# Altium project R32-Micro.PrjPCB
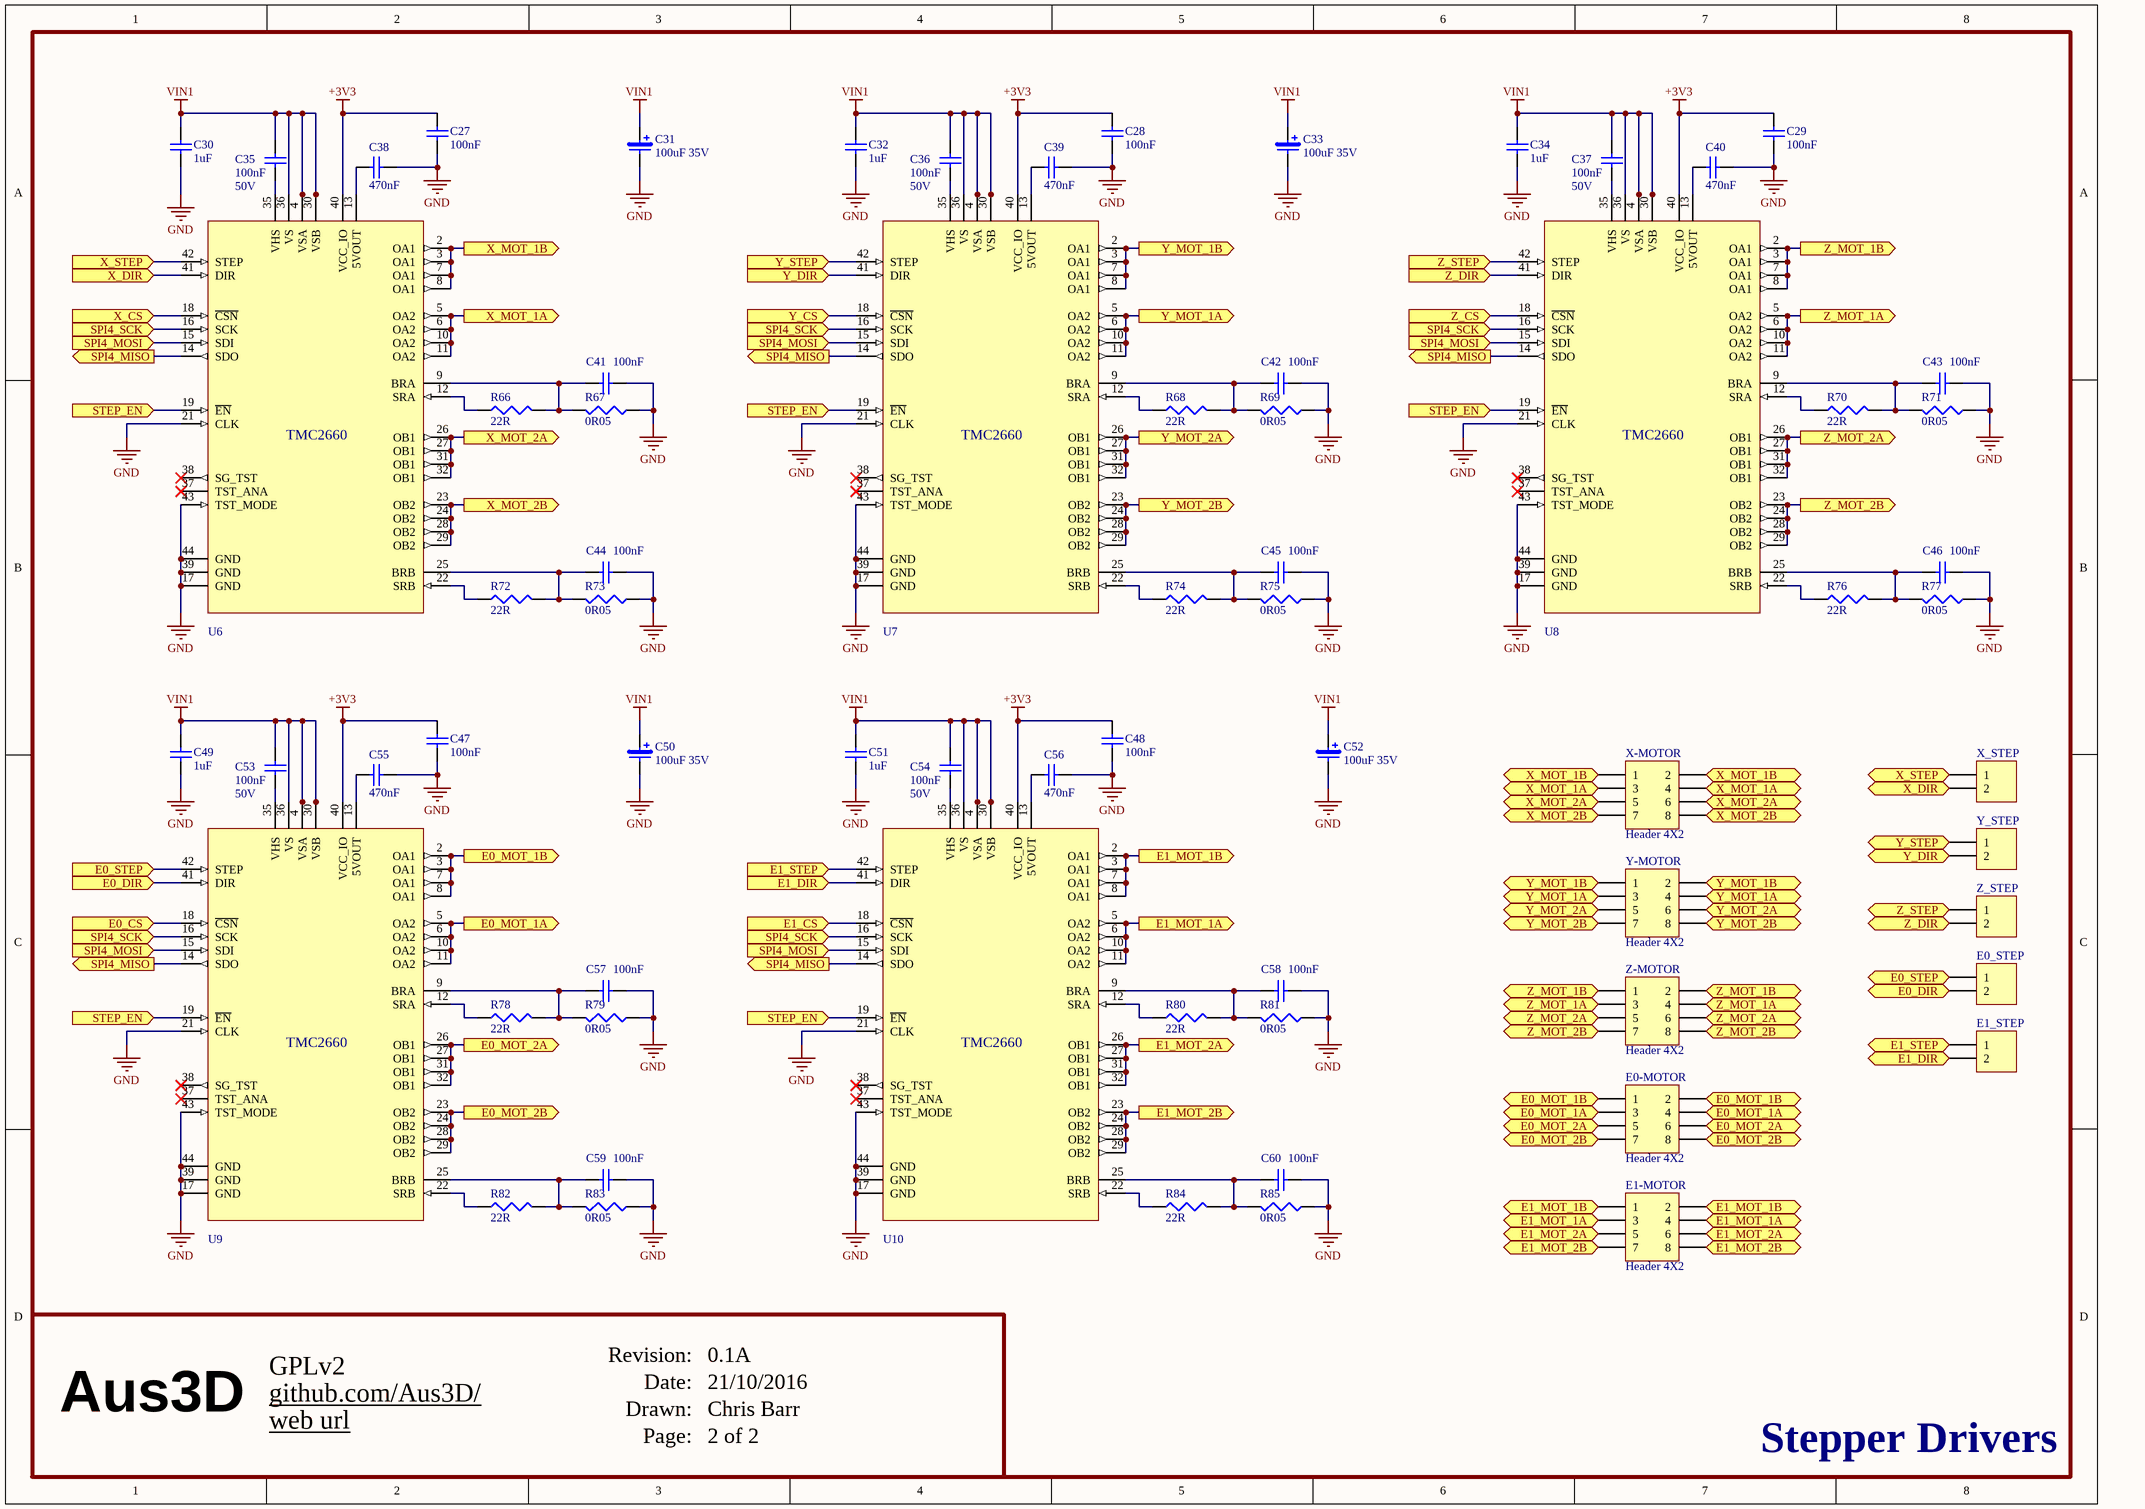
[diagram p0: stepperDrivers.SchDoc]
2 sheets, 220 parts. Net scope: flat (ports and power ports of the same name join across sheets).
Board file: R32-Micro.PcbDoc
Sheets:
  stepperDrivers.SchDoc
  R32-Micro.SchDoc

## Sheet stepperDrivers.SchDoc
size A3

### Parts
C27  value 100nF  [CAP 1005-0402]  (hidden comment: CapC-0402-100nF)
C28  value 100nF  [CAP 1005-0402]  (hidden comment: CapC-0402-100nF)
C29  value 100nF  [CAP 1005-0402]  (hidden comment: CapC-0402-100nF)
C30  value 1uF  [Cap 1608-0603]  (hidden comment: CapC-0603-1uF 50V)
C31  value 100uF 35V  [CAP EL PANASONIC]  (hidden comment: CapE-6.3-100uF-35V)
C32  value 1uF  [Cap 1608-0603]  (hidden comment: CapC-0603-1uF 50V)
C33  value 100uF 35V  [CAP EL PANASONIC]  (hidden comment: CapE-6.3-100uF-35V)
C34  value 1uF  [Cap 1608-0603]  (hidden comment: CapC-0603-1uF 50V)
C35  value 100nF  Voltage: 50V  [CAP 1005-0402]  (hidden comment: CapC-0402-100nF-50V)
C36  value 100nF  Voltage: 50V  [CAP 1005-0402]  (hidden comment: CapC-0402-100nF-50V)
C37  value 100nF  Voltage: 50V  [CAP 1005-0402]  (hidden comment: CapC-0402-100nF-50V)
C38  value 470nF  [CAP 1005-0402]  (hidden comment: CapC-0402-470nF)
C39  value 470nF  [CAP 1005-0402]  (hidden comment: CapC-0402-470nF)
C40  value 470nF  [CAP 1005-0402]  (hidden comment: CapC-0402-470nF)
C41  value 100nF  [CAP 1005-0402]  (hidden comment: CapC-0402-100nF)
C42  value 100nF  [CAP 1005-0402]  (hidden comment: CapC-0402-100nF)
C43  value 100nF  [CAP 1005-0402]  (hidden comment: CapC-0402-100nF)
C44  value 100nF  [CAP 1005-0402]  (hidden comment: CapC-0402-100nF)
C45  value 100nF  [CAP 1005-0402]  (hidden comment: CapC-0402-100nF)
C46  value 100nF  [CAP 1005-0402]  (hidden comment: CapC-0402-100nF)
C47  value 100nF  [CAP 1005-0402]  (hidden comment: CapC-0402-100nF)
C48  value 100nF  [CAP 1005-0402]  (hidden comment: CapC-0402-100nF)
C49  value 1uF  [Cap 1608-0603]  (hidden comment: CapC-0603-1uF 50V)
C50  value 100uF 35V  [CAP EL PANASONIC]  (hidden comment: CapE-6.3-100uF-35V)
C51  value 1uF  [Cap 1608-0603]  (hidden comment: CapC-0603-1uF 50V)
C52  value 100uF 35V  [CAP EL PANASONIC]  (hidden comment: CapE-6.3-100uF-35V)
C53  value 100nF  Voltage: 50V  [CAP 1005-0402]  (hidden comment: CapC-0402-100nF-50V)
C54  value 100nF  Voltage: 50V  [CAP 1005-0402]  (hidden comment: CapC-0402-100nF-50V)
C55  value 470nF  [CAP 1005-0402]  (hidden comment: CapC-0402-470nF)
C56  value 470nF  [CAP 1005-0402]  (hidden comment: CapC-0402-470nF)
C57  value 100nF  [CAP 1005-0402]  (hidden comment: CapC-0402-100nF)
C58  value 100nF  [CAP 1005-0402]  (hidden comment: CapC-0402-100nF)
C59  value 100nF  [CAP 1005-0402]  (hidden comment: CapC-0402-100nF)
C60  value 100nF  [CAP 1005-0402]  (hidden comment: CapC-0402-100nF)
E0-MOTOR  Header 4X2  [HDR2X4-HEADER]
E0_STEP  Header 2  [HEADER-1x2-50mil]  (value not drawn)
E1-MOTOR  Header 4X2  [HDR2X4-HEADER]
E1_STEP  Header 2  [HEADER-1x2-50mil]  (value not drawn)
R66  value 22R  [RESC1005X40N]  (hidden comment: Res-0402-22R)
R67  value 0R05  [Res 3216-1206]  (hidden comment: Res-1206-0R05)
R68  value 22R  [RESC1005X40N]  (hidden comment: Res-0402-22R)
R69  value 0R05  [Res 3216-1206]  (hidden comment: Res-1206-0R05)
R70  value 22R  [RESC1005X40N]  (hidden comment: Res-0402-22R)
R71  value 0R05  [Res 3216-1206]  (hidden comment: Res-1206-0R05)
R72  value 22R  [RESC1005X40N]  (hidden comment: Res-0402-22R)
R73  value 0R05  [Res 3216-1206]  (hidden comment: Res-1206-0R05)
R74  value 22R  [RESC1005X40N]  (hidden comment: Res-0402-22R)
R75  value 0R05  [Res 3216-1206]  (hidden comment: Res-1206-0R05)
R76  value 22R  [RESC1005X40N]  (hidden comment: Res-0402-22R)
R77  value 0R05  [Res 3216-1206]  (hidden comment: Res-1206-0R05)
R78  value 22R  [RESC1005X40N]  (hidden comment: Res-0402-22R)
R79  value 0R05  [Res 3216-1206]  (hidden comment: Res-1206-0R05)
R80  value 22R  [RESC1005X40N]  (hidden comment: Res-0402-22R)
R81  value 0R05  [Res 3216-1206]  (hidden comment: Res-1206-0R05)
R82  value 22R  [RESC1005X40N]  (hidden comment: Res-0402-22R)
R83  value 0R05  [Res 3216-1206]  (hidden comment: Res-1206-0R05)
R84  value 22R  [RESC1005X40N]  (hidden comment: Res-0402-22R)
R85  value 0R05  [Res 3216-1206]  (hidden comment: Res-1206-0R05)
U6  TMC2660  [TQFP80P1200X1200X160-44N]  (value not drawn)
U7  TMC2660  [TQFP80P1200X1200X160-44N]  (value not drawn)
U8  TMC2660  [TQFP80P1200X1200X160-44N]  (value not drawn)
U9  TMC2660  [TQFP80P1200X1200X160-44N]  (value not drawn)
U10  TMC2660  [TQFP80P1200X1200X160-44N]  (value not drawn)
X-MOTOR  Header 4X2  [HDR2X4-HEADER]
X_STEP  Header 2  [HEADER-1x2-50mil]  (value not drawn)
Y-MOTOR  Header 4X2  [HDR2X4-HEADER]
Y_STEP  Header 2  [HEADER-1x2-50mil]  (value not drawn)
Z-MOTOR  Header 4X2  [HDR2X4-HEADER]
Z_STEP  Header 2  [HEADER-1x2-50mil]  (value not drawn)

### Ports
E0_CS (in), E0_DIR (in), E0_MOT_1A (in), E0_MOT_1A (out), E0_MOT_1B (in), E0_MOT_1B (out), E0_MOT_2A (in), E0_MOT_2A (out), E0_MOT_2B (in), E0_MOT_2B (out), E0_STEP (in), E1_CS (in), E1_DIR (in), E1_MOT_1A (in), E1_MOT_1A (out), E1_MOT_1B (in), E1_MOT_1B (out), E1_MOT_2A (in), E1_MOT_2A (out), E1_MOT_2B (in), E1_MOT_2B (out), E1_STEP (in), SPI4_MISO (out), SPI4_MOSI (in), SPI4_SCK (in), STEP_EN (in), X_CS (in), X_DIR (in), X_MOT_1A (in), X_MOT_1A (out), X_MOT_1B (in), X_MOT_1B (out), X_MOT_2A (in), X_MOT_2A (out), X_MOT_2B (in), X_MOT_2B (out), X_STEP (in), Y_CS (in), Y_DIR (in), Y_MOT_1A (in), Y_MOT_1A (out), Y_MOT_1B (in), Y_MOT_1B (out), Y_MOT_2A (in), Y_MOT_2A (out), Y_MOT_2B (in), Y_MOT_2B (out), Y_STEP (in), Z_CS (in), Z_DIR (in), Z_MOT_1A (in), Z_MOT_1A (out), Z_MOT_1B (in), Z_MOT_1B (out), Z_MOT_2A (in), Z_MOT_2A (out), Z_MOT_2B (in), Z_MOT_2B (out), Z_STEP (in)

### Nets
+3V3: C27.2 C28.2 C29.2 C47.2 C48.2 U6.40(VCC_IO) U7.40(VCC_IO) U8.40(VCC_IO) U9.40(VCC_IO) U10.40(VCC_IO)
GND: C27.1 C28.1 C29.1 C30.1 C31.2 C32.1 C33.2 C34.1 C38.1 C39.1 C40.1 C41.1 C42.1 C43.1 C44.1 C45.1 C46.1 C47.1 C48.1 C49.1 C50.2 C51.1 C52.2 C55.1 C56.1 C57.1 C58.1 C59.1 C60.1 R67.1 R69.1 R71.1 R73.1 R75.1 R77.1 R79.1 R81.1 R83.1 R85.1 U6.17(GND) U6.21(CLK) U6.39(GND) U6.43(TST_MODE) U6.44(GND) U7.17(GND) U7.21(CLK) U7.39(GND) U7.43(TST_MODE) U7.44(GND) U8.17(GND) U8.21(CLK) U8.39(GND) U8.43(TST_MODE) U8.44(GND) U9.17(GND) U9.21(CLK) U9.39(GND) U9.43(TST_MODE) U9.44(GND) U10.17(GND) U10.21(CLK) U10.39(GND) U10.43(TST_MODE) U10.44(GND)
VIN1: C30.2 C31.1 C32.2 C33.1 C34.2 C35.2 C36.2 C37.2 C49.2 C50.1 C51.2 C52.1 C53.2 C54.2 U6.1(NC) U6.4(VSA) U6.30(VSB) U6.33(NC) U6.36(VS) U7.1(NC) U7.4(VSA) U7.30(VSB) U7.33(NC) U7.36(VS) U8.1(NC) U8.4(VSA) U8.30(VSB) U8.33(NC) U8.36(VS) U9.1(NC) U9.4(VSA) U9.30(VSB) U9.33(NC) U9.36(VS) U10.1(NC) U10.4(VSA) U10.30(VSB) U10.33(NC) U10.36(VS)
E0_CS: U9.18(~{CSN}) ; port E0_CS
E0_DIR: E0_STEP.2 U9.41(DIR) ; port E0_DIR
E0_MOT_1A: E0-MOTOR.3 E0-MOTOR.4 U9.5(OA2) U9.6(OA2) U9.10(OA2) U9.11(OA2) ; port E0_MOT_1A
E0_MOT_1B: E0-MOTOR.1 E0-MOTOR.2 U9.2(OA1) U9.3(OA1) U9.7(OA1) U9.8(OA1) ; port E0_MOT_1B
E0_MOT_2A: E0-MOTOR.5 E0-MOTOR.6 U9.26(OB1) U9.27(OB1) U9.31(OB1) U9.32(OB1) ; port E0_MOT_2A
E0_MOT_2B: E0-MOTOR.7 E0-MOTOR.8 U9.23(OB2) U9.24(OB2) U9.28(OB2) U9.29(OB2) ; port E0_MOT_2B
E0_STEP: E0_STEP.1 U9.42(STEP) ; port E0_STEP
E1_CS: U10.18(~{CSN}) ; port E1_CS
E1_DIR: E1_STEP.2 U10.41(DIR) ; port E1_DIR
E1_MOT_1A: E1-MOTOR.3 E1-MOTOR.4 U10.5(OA2) U10.6(OA2) U10.10(OA2) U10.11(OA2) ; port E1_MOT_1A
E1_MOT_1B: E1-MOTOR.1 E1-MOTOR.2 U10.2(OA1) U10.3(OA1) U10.7(OA1) U10.8(OA1) ; port E1_MOT_1B
E1_MOT_2A: E1-MOTOR.5 E1-MOTOR.6 U10.26(OB1) U10.27(OB1) U10.31(OB1) U10.32(OB1) ; port E1_MOT_2A
E1_MOT_2B: E1-MOTOR.7 E1-MOTOR.8 U10.23(OB2) U10.24(OB2) U10.28(OB2) U10.29(OB2) ; port E1_MOT_2B
E1_STEP: E1_STEP.1 U10.42(STEP) ; port E1_STEP
SPI4_MISO: U6.14(SDO) U7.14(SDO) U8.14(SDO) U9.14(SDO) U10.14(SDO) ; port SPI4_MISO
SPI4_MOSI: U6.15(SDI) U7.15(SDI) U8.15(SDI) U9.15(SDI) U10.15(SDI) ; port SPI4_MOSI
SPI4_SCK: U6.16(SCK) U7.16(SCK) U8.16(SCK) U9.16(SCK) U10.16(SCK) ; port SPI4_SCK
STEP_EN: U6.19(~{EN}) U7.19(~{EN}) U8.19(~{EN}) U9.19(~{EN}) U10.19(~{EN}) ; port STEP_EN
X_CS: U6.18(~{CSN}) ; port X_CS
X_DIR: U6.41(DIR) X_STEP.2 ; port X_DIR
X_MOT_1A: U6.5(OA2) U6.6(OA2) U6.10(OA2) U6.11(OA2) X-MOTOR.3 X-MOTOR.4 ; port X_MOT_1A
X_MOT_1B: U6.2(OA1) U6.3(OA1) U6.7(OA1) U6.8(OA1) X-MOTOR.1 X-MOTOR.2 ; port X_MOT_1B
X_MOT_2A: U6.26(OB1) U6.27(OB1) U6.31(OB1) U6.32(OB1) X-MOTOR.5 X-MOTOR.6 ; port X_MOT_2A
X_MOT_2B: U6.23(OB2) U6.24(OB2) U6.28(OB2) U6.29(OB2) X-MOTOR.7 X-MOTOR.8 ; port X_MOT_2B
X_STEP: U6.42(STEP) X_STEP.1 ; port X_STEP
Y_CS: U7.18(~{CSN}) ; port Y_CS
Y_DIR: U7.41(DIR) Y_STEP.2 ; port Y_DIR
Y_MOT_1A: U7.5(OA2) U7.6(OA2) U7.10(OA2) U7.11(OA2) Y-MOTOR.3 Y-MOTOR.4 ; port Y_MOT_1A
Y_MOT_1B: U7.2(OA1) U7.3(OA1) U7.7(OA1) U7.8(OA1) Y-MOTOR.1 Y-MOTOR.2 ; port Y_MOT_1B
Y_MOT_2A: U7.26(OB1) U7.27(OB1) U7.31(OB1) U7.32(OB1) Y-MOTOR.5 Y-MOTOR.6 ; port Y_MOT_2A
Y_MOT_2B: U7.23(OB2) U7.24(OB2) U7.28(OB2) U7.29(OB2) Y-MOTOR.7 Y-MOTOR.8 ; port Y_MOT_2B
Y_STEP: U7.42(STEP) Y_STEP.1 ; port Y_STEP
Z_CS: U8.18(~{CSN}) ; port Z_CS
Z_DIR: U8.41(DIR) Z_STEP.2 ; port Z_DIR
Z_MOT_1A: U8.5(OA2) U8.6(OA2) U8.10(OA2) U8.11(OA2) Z-MOTOR.3 Z-MOTOR.4 ; port Z_MOT_1A
Z_MOT_1B: U8.2(OA1) U8.3(OA1) U8.7(OA1) U8.8(OA1) Z-MOTOR.1 Z-MOTOR.2 ; port Z_MOT_1B
Z_MOT_2A: U8.26(OB1) U8.27(OB1) U8.31(OB1) U8.32(OB1) Z-MOTOR.5 Z-MOTOR.6 ; port Z_MOT_2A
Z_MOT_2B: U8.23(OB2) U8.24(OB2) U8.28(OB2) U8.29(OB2) Z-MOTOR.7 Z-MOTOR.8 ; port Z_MOT_2B
Z_STEP: U8.42(STEP) Z_STEP.1 ; port Z_STEP
NetC35_1: C35.1 U6.35(VHS)
NetC36_1: C36.1 U7.35(VHS)
NetC37_1: C37.1 U8.35(VHS)
NetC38_2: C38.2 U6.13(5VOUT)
NetC39_2: C39.2 U7.13(5VOUT)
NetC40_2: C40.2 U8.13(5VOUT)
NetC41_2: C41.2 R66.2 R67.2 U6.9(BRA)
NetC42_2: C42.2 R68.2 R69.2 U7.9(BRA)
NetC43_2: C43.2 R70.2 R71.2 U8.9(BRA)
NetC44_2: C44.2 R72.2 R73.2 U6.25(BRB)
NetC45_2: C45.2 R74.2 R75.2 U7.25(BRB)
NetC46_2: C46.2 R76.2 R77.2 U8.25(BRB)
NetC53_1: C53.1 U9.35(VHS)
NetC54_1: C54.1 U10.35(VHS)
NetC55_2: C55.2 U9.13(5VOUT)
NetC56_2: C56.2 U10.13(5VOUT)
NetC57_2: C57.2 R78.2 R79.2 U9.9(BRA)
NetC58_2: C58.2 R80.2 R81.2 U10.9(BRA)
NetC59_2: C59.2 R82.2 R83.2 U9.25(BRB)
NetC60_2: C60.2 R84.2 R85.2 U10.25(BRB)
NetR66_1: R66.1 U6.12(SRA)
NetR68_1: R68.1 U7.12(SRA)
NetR70_1: R70.1 U8.12(SRA)
NetR72_1: R72.1 U6.22(SRB)
NetR74_1: R74.1 U7.22(SRB)
NetR76_1: R76.1 U8.22(SRB)
NetR78_1: R78.1 U9.12(SRA)
NetR80_1: R80.1 U10.12(SRA)
NetR82_1: R82.1 U9.22(SRB)
NetR84_1: R84.1 U10.22(SRB)

Not connected (* = marked no-connect by the designer): U6 37(TST_ANA)* 38(SG_TST)*; U7 37(TST_ANA)* 38(SG_TST)*; U8 37(TST_ANA)* 38(SG_TST)*; U9 37(TST_ANA)* 38(SG_TST)*; U10 37(TST_ANA)* 38(SG_TST)*

### Notes on the sheet
- GPLv2
- Date:
- Revision:
- 0.1A
- 21/10/2016
- Aus3D
- github.com/Aus3D/
- web url
- Drawn:
- Page:
- Chris Barr
- 2 of 2
- Stepper Drivers

### Library data of the parts
C27-C29 C41-C48 C57-C60 = CapC-0402-100nF: Capacitor (Semiconductor SIM Model); Note: Approved sub OK; Published: 8-Jun-2000; Revision: July-2002: Re-released for DXP Platform.; Publisher: Altium Limited; Supplier 1: Digi-Key; Supplier Part Number 1: 311-1336-1-ND
C30 C32 C34 C49 C51 = CapC-0603-1uF 50V: Capacitor (Semiconductor SIM Model); Note: Approved sub OK; Published: 8-Jun-2000; Revision: July-2002: Re-released for DXP Platform.; Publisher: Altium Limited; Supplier 1: Digi-Key; Supplier Part Number 1: 1276-1860-1-ND
C31 C33 C50 C52 = CapE-6.3-100uF-35V: Polarized Capacitor (Surface Mount); Note: Approved sub OK; Published: 8-Jun-2000; Revision: July-2002: Re-released for DXP Platform.; Publisher: Altium Limited; Supplier 1: Digi-Key; Supplier Part Number 1: PCE5016CT-ND
C35-C37 C53 C54 = CapC-0402-100nF-50V: Capacitor (Semiconductor SIM Model); Note: Approved sub OK; Published: 8-Jun-2000; Revision: July-2002: Re-released for DXP Platform.; Publisher: Altium Limited; Supplier 1: Digi-Key; Supplier Part Number 1: 490-10700-1-ND
C38-C40 C55 C56 = CapC-0402-470nF: Capacitor (Semiconductor SIM Model); Note: Approved sub OK; Published: 8-Jun-2000; Revision: July-2002: Re-released for DXP Platform.; Publisher: Altium Limited; Supplier 1: Digi-Key; Supplier Part Number 1: 1276-1173-1-ND
E0-MOTOR E1-MOTOR X-MOTOR Y-MOTOR Z-MOTOR = Header 4X2: Header, 4-Pin, Dual row; Note: Approved sub OK; LatestRevisionDate: 17-Jul-2002; LatestRevisionNote: Re-released for DXP Platform.; Publisher: Altium Limited; Supplier 1: Digi-Key; Supplier Part Number 1: 961208-6404-AR-ND
E0_STEP E1_STEP X_STEP Y_STEP Z_STEP = Header 2: Header, 2-Pin; Note: Approved sub OK; LatestRevisionDate: 17-Jul-2002; LatestRevisionNote: Re-released for DXP Platform.; Publisher: Altium Limited; Supplier 1: Digi-Key; Supplier Part Number 1: 3M9447-ND
R66 R68 R70 R72 R74 R76 R78 R80 R82 R84 = Res-0402-22R: Resistor; Note: Approved sub OK; Published: 8-Jun-2000; Revision: July-2002: Re-released for DXP Platform.; Publisher: Altium Limited; Supplier 1: Digi-Key; Supplier Part Number 1: 311-22JRCT-ND
R67 R69 R71 R73 R75 R77 R79 R81 R83 R85 = Res-1206-0R05: Resistor; Note: Approved sub OK; Published: 8-Jun-2000; Revision: July-2002: Re-released for DXP Platform.; Publisher: Altium Limited; Supplier 1: Digi-Key; Supplier Part Number 1: 73E4R050JCT-ND
U6-U10 = TMC2660: Stepper Driver IC; Supplier 1: Digi-Key; Supplier Part Number 1: 1460-1062-1-ND

## Sheet R32-Micro.SchDoc
size A2; PageSetup: Record=PageOptions|CenterHorizontal=True|CenterVertical=True|PrintScale=0.68|XCorrection=1.00|YCorrection=1.00|PrintKind=1|BorderSize=5000000|LeftOffset=0|BottomOffset=0|Orientation=2|PaperLength=1000|PaperWidth=1000|Scale=100|PaperSource=7|PrintQuality=-4|MediaType=1|DitherType=10|PrintScaleMode=1|PaperKind=A3
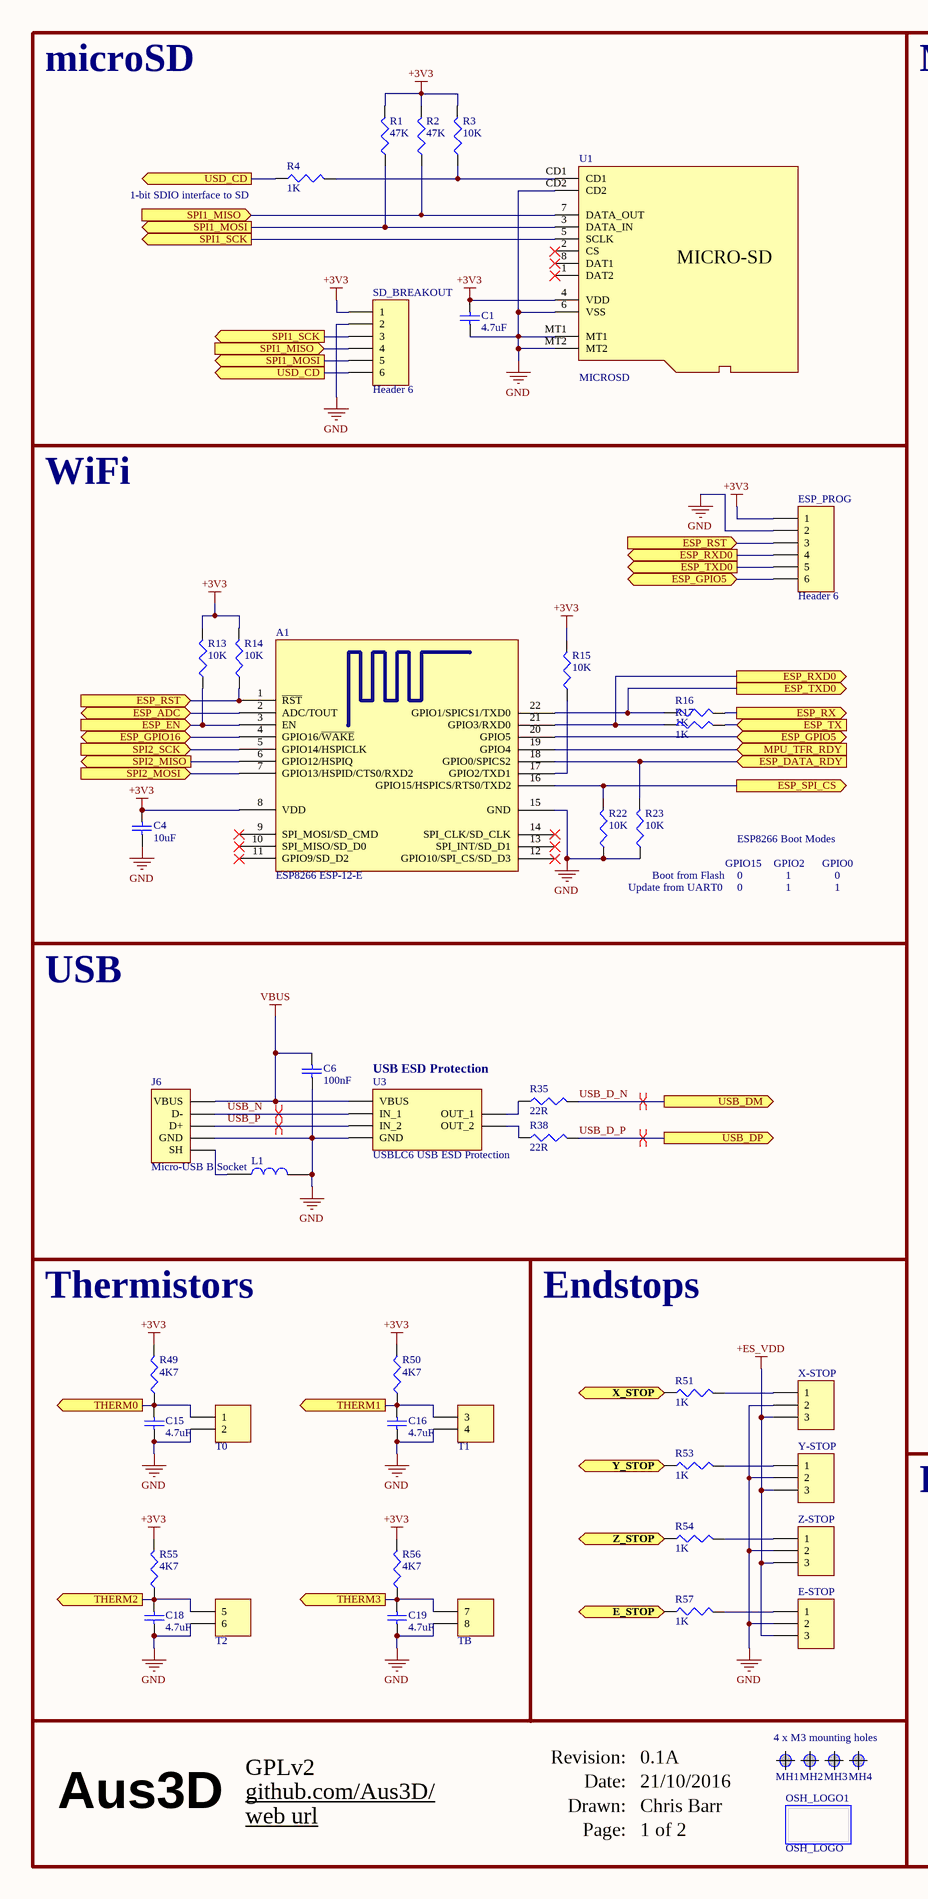
[diagram p1: R32-Micro.SchDoc, left]
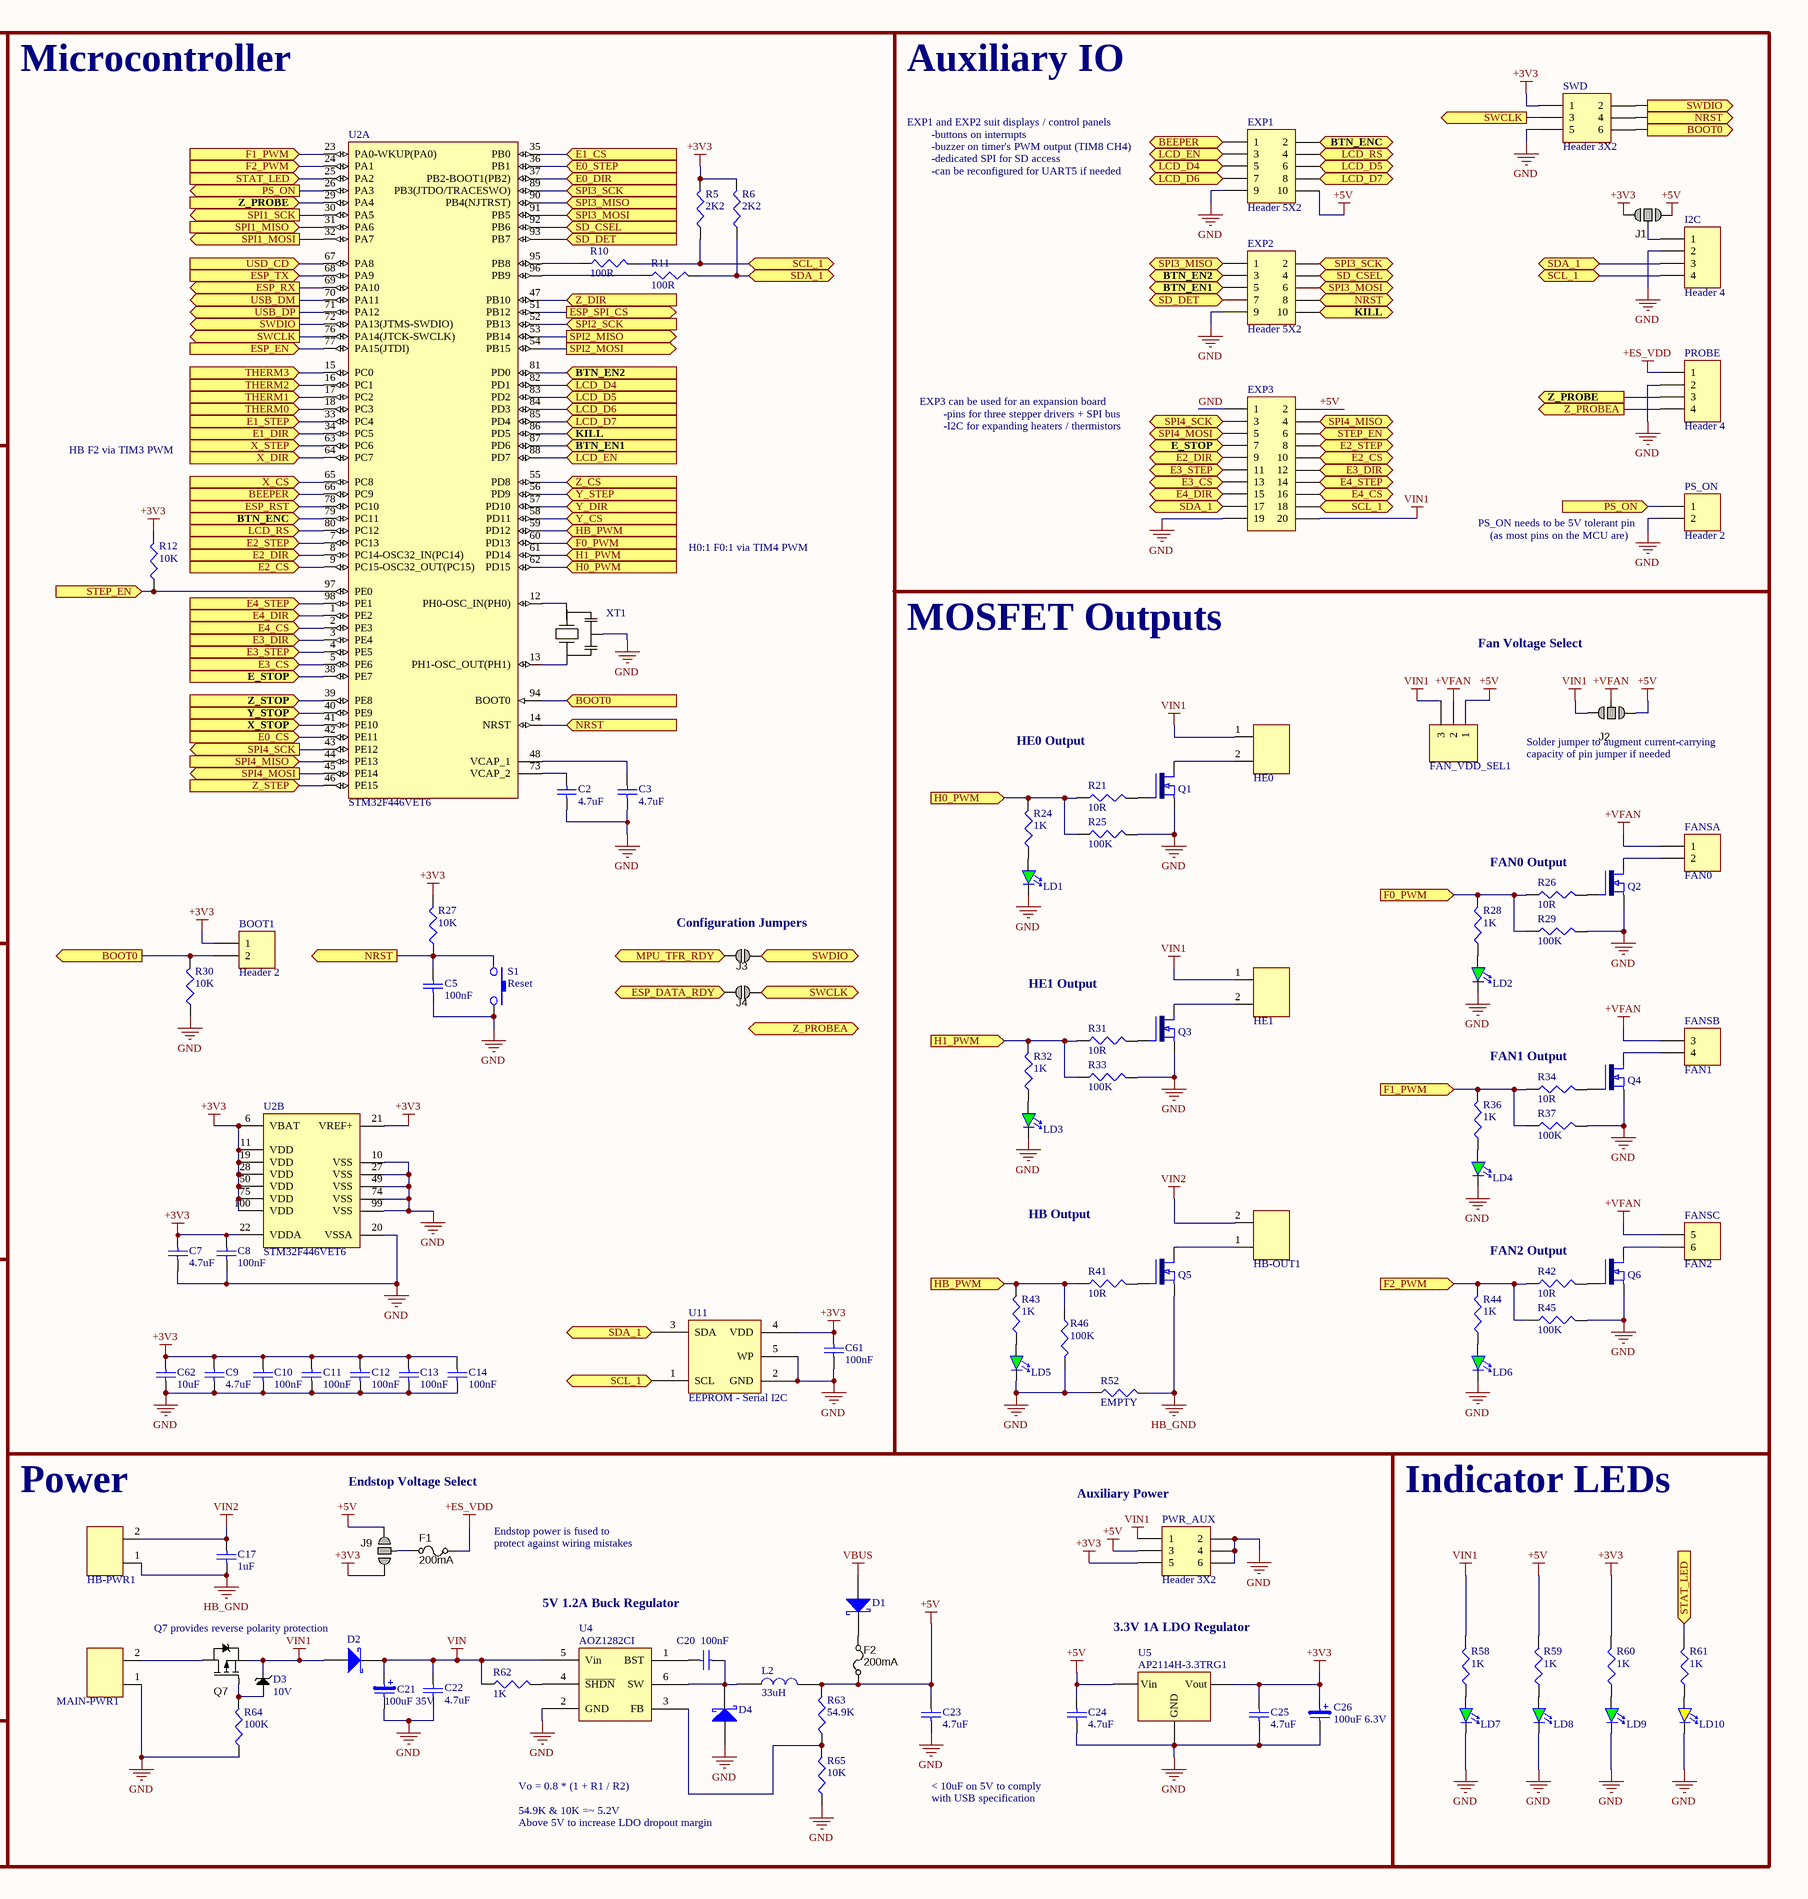
[diagram p2: R32-Micro.SchDoc, right]

### Parts
A1  ESP8266 ESP-12-E  [ESP8266 ESP-12-E-SMD]  (no BOM)
BOOT1  Header 2  [HDR1X2-HEADER]
C1  value 4.7uF  [CAP 1005-0402]  (hidden comment: CapC-0402-4.7uF-10V)
C2  value 4.7uF  [CAP 1005-0402]  (hidden comment: CapC-0402-4.7uF-10V)
C3  value 4.7uF  [CAP 1005-0402]  (hidden comment: CapC-0402-4.7uF-10V)
C4  value 10uF  [CAPC2012X135N]  (hidden comment: CapC-0805-10uF 6.3V)
C5  value 100nF  [CAP 1005-0402]  (hidden comment: CapC-0402-100nF)
C6  value 100nF  [CAP 1005-0402]  (hidden comment: CapC-0402-100nF)
C7  value 4.7uF  [CAP 1005-0402]  (hidden comment: CapC-0402-4.7uF-10V)
C8  value 100nF  [CAP 1005-0402]  (hidden comment: CapC-0402-100nF)
C9  value 4.7uF  [CAP 1005-0402]  (hidden comment: CapC-0402-4.7uF-10V)
C10  value 100nF  [CAP 1005-0402]  (hidden comment: CapC-0402-100nF)
C11  value 100nF  [CAP 1005-0402]  (hidden comment: CapC-0402-100nF)
C12  value 100nF  [CAP 1005-0402]  (hidden comment: CapC-0402-100nF)
C13  value 100nF  [CAP 1005-0402]  (hidden comment: CapC-0402-100nF)
C14  value 100nF  [CAP 1005-0402]  (hidden comment: CapC-0402-100nF)
C15  value 4.7uF  [CAP 1005-0402]  (hidden comment: CapC-0402-4.7uF-10V)
C16  value 4.7uF  [CAP 1005-0402]  (hidden comment: CapC-0402-4.7uF-10V)
C17  value 1uF  [Cap 1608-0603]  (hidden comment: CapC-0603-1uF 50V)
C18  value 4.7uF  [CAP 1005-0402]  (hidden comment: CapC-0402-4.7uF-10V)
C19  value 4.7uF  [CAP 1005-0402]  (hidden comment: CapC-0402-4.7uF-10V)
C20  value 100nF  [CAP 1005-0402]  (hidden comment: CapC-0402-100nF)
C21  value 100uF 35V  [CAP EL PANASONIC]  (hidden comment: CapE-6.3-100uF-35V)
C22  value 4.7uF  [CAP 3225-1210]  (hidden comment: CapC-1210-4.7uF-50V)
C23  value 4.7uF  [CAPC2012X135N]  (hidden comment: CapC-0805-4.7uF 10V)
C24  value 4.7uF  [CAPC2012X135N]  (hidden comment: CapC-0805-4.7uF 10V)
C25  value 4.7uF  [CAP 1005-0402]  (hidden comment: CapC-0402-4.7uF-10V)
C26  value 100uF 6.3V  [CAP EL 5mm]  (hidden comment: CapE-5.0-100uF-6.3V)
C61  value 100nF  [CAP 1005-0402]  (hidden comment: CapC-0402-100nF)
C62  value 10uF  [CAPC2012X135N]  (hidden comment: CapC-0805-10uF 6.3V)
D1  Diode Schottky 700mA 20V  [SC-85]  (value not drawn)
D2  Diode Schottky 2A 40V  [DIOM2616X08N]  (value not drawn)
D3  Voltage: 10V  [SOD523]  (hidden comment: Diode Zener 10V)
D4  Diode Schottky 2A 40V  [DIOM2616X08N]  (value not drawn)
E-STOP  Header 3  [HDR1X3-HEADER]  (value not drawn)
ESP_PROG  Header 6  [HDR1X6-HEADER]
EXP1  Header 5X2  [HDR2X5_exp Iner only\]
EXP2  Header 5X2  [HDR2X5_exp Iner only\]
EXP3  Header 10X2  [HDR2X10-HEADER]  (value not drawn)
F1  value 200mA  [PTC Fuse1608-0603]  (hidden comment: PTC Resettable Fuse)
F2  value 200mA  [PTC Fuse1608-0603]  (hidden comment: PTC Resettable Fuse)
FAN_VDD_SEL1  Header 3  [HDR1X3-HEADER]  (value not drawn)
FANS  FAN0  [HDR2X3-Header]  (parts A,B,C of 3)
HB-OUT1  Screw Terminal 5mm 2-Way  [TERM2 5MM]  (value not drawn)
HB-PWR1  Screw Terminal 5mm 2-Way  [TERM2 5MM]  (value not drawn)
HE0  Screw Terminal 3.5mm 2-Way  [TERM2 3.5mm]  (value not drawn)
HE1  Screw Terminal 3.5mm 2-Way  [TERM2 3.5mm]  (value not drawn)
I2C  Header 4  [HDR1X4-HEADER]
J1  Jumper  [JUMPER-3-NO]  (value not drawn)  (no BOM)
J2  Jumper  [JUMPER-3-NO-BIG]  (value not drawn)  (no BOM)
J3  Jumper  [JUMPER-2-NO]  (value not drawn)  (no BOM)
J4  Jumper  [JUMPER-2-NO]  (value not drawn)  (no BOM)
J6  Micro-USB B Socket  [Micro-USB B Molex 105017-0001]
J9  Jumper  [JUMPER-3-NO]  (value not drawn)  (no BOM)
L1  Ferrite Bead SMD 0805  [Res 2012-0805]  (value not drawn)
L2  value 33uH  [SRN6045TA SMD Inductor]  (hidden comment: Inductor SMD 33uH 2.5A)
LD1  GREEN  [LED 1608-0603]  (value not drawn)
LD2  GREEN  [LED 1608-0603]  (value not drawn)
LD3  GREEN  [LED 1608-0603]  (value not drawn)
LD4  GREEN  [LED 1608-0603]  (value not drawn)
LD5  GREEN  [LED 1608-0603]  (value not drawn)
LD6  GREEN  [LED 1608-0603]  (value not drawn)
LD7  GREEN  [LED 1608-0603]  (value not drawn)
LD8  GREEN  [LED 1608-0603]  (value not drawn)
LD9  GREEN  [LED 1608-0603]  (value not drawn)
LD10  YELLOW  [LED 1608-0603]  (value not drawn)
MAIN-PWR1  Screw Terminal 5mm 2-Way  [TERM2 5MM]  (value not drawn)
MH1  Screw Hole  [M3-Hole-2]  (value not drawn)  (no BOM)
MH2  Screw Hole  [M3-Hole-2]  (value not drawn)  (no BOM)
MH3  Screw Hole  [M3-Hole-2]  (value not drawn)  (no BOM)
MH4  Screw Hole  [M3-Hole-2]  (value not drawn)  (no BOM)
OSH_LOGO1  OSH_LOGO  [OSHW-LOGO-L]  (no BOM)
PROBE  Header 4  [HDR1X4-HEADER]
PS_ON  Header 2  [HDR1X2-HEADER]
PWR_AUX  Header 3X2  [HDR2X3-Header]
Q1  MOSFET - AO3400A  [SOT23-3 New]  (value not drawn)
Q2  MOSFET - AO3400A  [SOT23-3 New]  (value not drawn)
Q3  MOSFET - AO3400A  [SOT23-3 New]  (value not drawn)
Q4  MOSFET - AO3400A  [SOT23-3 New]  (value not drawn)
Q5  PSMN1R8-40YLC  [LFPACK]  (value not drawn)
Q6  MOSFET - AO3400A  [SOT23-3 New]  (value not drawn)
Q7  SIA453EDJ-T1-GE3  [PowerPAK SC-70]  (value not drawn)
R1  value 47K  [RESC1005X40N]  (hidden comment: Res-0402-47K)
R2  value 47K  [RESC1005X40N]  (hidden comment: Res-0402-47K)
R3  value 10K  [RESC1005X40N]  (hidden comment: Res-0402-10K)
R4  value 1K  [RESC1005X40N]  (hidden comment: Res-0402-1K)
R5  value 2K2  [RESC1005X40N]  (hidden comment: Res-0402-2K2)
R6  value 2K2  [RESC1005X40N]  (hidden comment: Res-0402-2K2)
R10  value 100R  [RESC1005X40N]  (hidden comment: Res-0402-100R)
R11  value 100R  [RESC1005X40N]  (hidden comment: Res-0402-100R)
R12  value 10K  [RESC1005X40N]  (hidden comment: Res-0402-10K)
R13  value 10K  [RESC1005X40N]  (hidden comment: Res-0402-10K)
R14  value 10K  [RESC1005X40N]  (hidden comment: Res-0402-10K)
R15  value 10K  [RESC1005X40N]  (hidden comment: Res-0402-10K)
R16  value 1K  [RESC1005X40N]  (hidden comment: Res-0402-1K)
R17  value 1K  [RESC1005X40N]  (hidden comment: Res-0402-1K)
R21  value 10R  [RESC1005X40N]  (hidden comment: Res-0402-10R)
R22  value 10K  [RESC1005X40N]  (hidden comment: Res-0402-10K)
R23  value 10K  [RESC1005X40N]  (hidden comment: Res-0402-10K)
R24  value 1K  [RESC1005X40N]  (hidden comment: Res-0402-1K)
R25  value 100K  [RESC1005X40N]  (hidden comment: Res-0402-100K)
R26  value 10R  [RESC1005X40N]  (hidden comment: Res-0402-10R)
R27  value 10K  [RESC1005X40N]  (hidden comment: Res-0402-10K)
R28  value 1K  [RESC1005X40N]  (hidden comment: Res-0402-1K)
R29  value 100K  [RESC1005X40N]  (hidden comment: Res-0402-100K)
R30  value 10K  [RESC1005X40N]  (hidden comment: Res-0402-10K)
R31  value 10R  [RESC1005X40N]  (hidden comment: Res-0402-10R)
R32  value 1K  [RESC1005X40N]  (hidden comment: Res-0402-1K)
R33  value 100K  [RESC1005X40N]  (hidden comment: Res-0402-100K)
R34  value 10R  [RESC1005X40N]  (hidden comment: Res-0402-10R)
R35  value 22R  [RESC1005X40N]  (hidden comment: Res-0402-22R)
R36  value 1K  [RESC1005X40N]  (hidden comment: Res-0402-1K)
R37  value 100K  [RESC1005X40N]  (hidden comment: Res-0402-100K)
R38  value 22R  [RESC1005X40N]  (hidden comment: Res-0402-22R)
R41  value 10R  [RESC1005X40N]  (hidden comment: Res-0402-10R)
R42  value 10R  [RESC1005X40N]  (hidden comment: Res-0402-10R)
R43  value 1K  [RESC1005X40N]  (hidden comment: Res-0402-1K)
R44  value 1K  [RESC1005X40N]  (hidden comment: Res-0402-1K)
R45  value 100K  [RESC1005X40N]  (hidden comment: Res-0402-100K)
R46  value 100K  [RESC1005X40N]  (hidden comment: Res-0402-100K)
R49  value 4K7  [RESC1005X40N]  (hidden comment: Res-0402-4K7)
R50  value 4K7  [RESC1005X40N]  (hidden comment: Res-0402-4K7)
R51  value 1K  [RESC1005X40N]  (hidden comment: Res-0402-1K)
R52  value EMPTY  [RESC1005X40N]  (hidden comment: Res-0402-EMPTY)  (no BOM)
R53  value 1K  [RESC1005X40N]  (hidden comment: Res-0402-1K)
R54  value 1K  [RESC1005X40N]  (hidden comment: Res-0402-1K)
R55  value 4K7  [RESC1005X40N]  (hidden comment: Res-0402-4K7)
R56  value 4K7  [RESC1005X40N]  (hidden comment: Res-0402-4K7)
R57  value 1K  [RESC1005X40N]  (hidden comment: Res-0402-1K)
R58  value 1K  [RESC1005X40N]  (hidden comment: Res-0402-1K)
R59  value 1K  [RESC1005X40N]  (hidden comment: Res-0402-1K)
R60  value 1K  [RESC1005X40N]  (hidden comment: Res-0402-1K)
R61  value 1K  [RESC1005X40N]  (hidden comment: Res-0402-1K)
R62  value 1K  [RESC1005X40N]  (hidden comment: Res-0402-1K)
R63  value 54.9K  [RESC1005X40N]  (hidden comment: Res-0402-54.9K)
R64  value 100K  [RESC1005X40N]  (hidden comment: Res-0402-100K)
R65  value 10K  [RESC1005X40N]  (hidden comment: Res-0402-10K)
S1  Reset  [SW-PB SMD 2pin]
SD_BREAKOUT  Header 6  [HDR1X6-HEADER]
SWD  Header 3X2  [HDR2X3-Header]
THERM_HEADER  T0  [HDR1X8-HEADER]  (parts A,B,C,D of 4)
U1  MICROSD  [MICRO-SD]
U2  STM32F446VET6  [STM-LQFP100_N]  (parts A,B of 2)
U3  USBLC6 USB ESD Protection  [SOT23-6N]
U4  AOZ1282CI  [SOT23-6N]
U5  AP2114H-3.3TRG1  [SOT229P700X180-4N]
U11  EEPROM - Serial I2C  [SOT23-5]
X-STOP  Header 3  [HDR1X3-HEADER]  (value not drawn)
XT1  Ceramic Resonator CSTCE12M0G55-R0  [CERALOCK CSTCE_G]  (value not drawn)
Y-STOP  Header 3  [HDR1X3-HEADER]  (value not drawn)
Z-STOP  Header 3  [HDR1X3-HEADER]  (value not drawn)

### Blocks framed on the sheet
microSD: C1 R1-R4 SD_BREAKOUT U1
Microcontroller: BOOT1 C2 C3 C5 C7-C14 C61 C62 J3 J4 R5 R6 R10-R12 R27 R30 S1 U2 U11 XT1
Auxiliary IO: EXP1-EXP3 I2C J1 PROBE PS_ON SWD
WiFi: A1 C4 ESP_PROG R13-R17 R22 R23
MOSFET Outputs: FAN_VDD_SEL1 FANS HB-OUT1 HE0 HE1 J2 LD1-LD6 Q1-Q6 R21 R24-R26 R28 R29 R31-R34 R36 R37 R41-R46 R52
USB: C6 J6 L1 R35 R38 U3
Thermistors: C15 C16 C18 C19 R49 R50 R55 R56 THERM_HEADER
Endstops: E-STOP R51 R53 R54 R57 X-STOP Y-STOP Z-STOP
Power: C17 C20-C26 D1-D4 F1 F2 HB-PWR1 J9 L2 MAIN-PWR1 PWR_AUX Q7 R62-R65 U4 U5
Indicator LEDs: LD7-LD10 R58-R61
Aus3D: MH1-MH4 OSH_LOGO1

### Ports
BEEPER (in), BOOT0 (in), BOOT0 (out), BTN_EN1 (in), BTN_EN1 (out), BTN_EN2 (in), BTN_EN2 (out), BTN_ENC (in), BTN_ENC (out), E0_CS (in), E0_DIR (in), E0_STEP (in), E1_CS (in), E1_DIR (in), E1_STEP (in), E2_CS (in), E2_DIR (in), E2_STEP (in), E3_CS (in), E3_DIR (in), E3_STEP (in), E4_CS (in), E4_DIR (in), E4_STEP (in), E_STOP (in), E_STOP (out), ESP_ADC (bidir), ESP_DATA_RDY (in), ESP_EN (in), ESP_GPIO5 (bidir), ESP_GPIO16 (bidir), ESP_RST (in), ESP_RX (out), ESP_RXD0 (out), ESP_SPI_CS (out), ESP_TX (in), ESP_TXD0 (out), F0_PWM (in), F1_PWM (in), F2_PWM (in), H0_PWM (in), H1_PWM (in), HB_PWM (in), KILL (in), KILL (out), LCD_D4 (in), LCD_D5 (in), LCD_D6 (in), LCD_D7 (in), LCD_EN (in), LCD_RS (in), MPU_TFR_RDY (in), NRST (in), NRST (out), PS_ON (in), PS_ON (out), SCL_1 (bidir), SD_CSEL (in), SD_DET (in), SD_DET (out), SDA_1 (bidir), SPI1_MISO (in), SPI1_MOSI (out), SPI1_SCK (out), SPI2_MISO (out), SPI2_MOSI (in), SPI2_MOSI (out), SPI2_SCK (in), SPI3_MISO (in), SPI3_MOSI (in), SPI3_SCK (in), SPI4_MISO (in), SPI4_MOSI (out), SPI4_SCK (out), STAT_LED (in), STEP_EN (in), SWCLK (out), SWDIO (out), THERM0 (in), THERM0 (out), THERM1 (in), THERM1 (out), THERM2 (in), THERM2 (out), THERM3 (in), THERM3 (out), USB_DM (out), USB_DP (out), USD_CD (in), USD_CD (out), X_CS (in), X_DIR (in), X_STEP (in), X_STOP (in), X_STOP (out), Y_CS (in), Y_DIR (in), Y_STEP (in), Y_STOP (in), Y_STOP (out), Z_CS (in), Z_DIR (in), Z_PROBE (in), Z_PROBE (out), Z_PROBEA (in), Z_PROBEA (out), Z_STEP (in), Z_STOP (in), Z_STOP (out)

### Nets
+3V3: A1.8(VDD) BOOT1.1 C1.2 C4.2 C7.2 C8.2 C9.2 C10.2 C11.2 C12.2 C13.2 C14.2 C25.2 C26.1 C61.2 C62.2 ESP_PROG.1 J1.1 J9.1 PWR_AUX.5 R1.2 R2.2 R3.2 R5.2 R6.2 R12.2 R13.2 R14.2 R15.2 R27.2 R49.2 R50.2 R55.2 R56.2 R60.2 SD_BREAKOUT.1 SWD.1 U1.4(VDD) U2.6(VBAT) U2.11(VDD) U2.19(VDD) U2.21(VREF+) U2.22(VDDA) U2.28(VDD) U2.50(VDD) U2.75(VDD) U2.100(VDD) U5.Vout U11.4(VDD)
+5V: C23.2 C24.2 EXP1.10 EXP3.2 F2.1 FAN_VDD_SEL1.1 J1.3 J2.1 J9.3 L2.2 PWR_AUX.3 R59.2 R63.2 U5.Vin
+ES_VDD: E-STOP.3 F1.2 PROBE.1 X-STOP.3 Y-STOP.3 Z-STOP.3
+VFAN: FAN_VDD_SEL1.2 FANS.1 FANS.3 FANS.5 J2.2
GND: A1.15(GND) C1.1 C2.1 C3.1 C4.1 C5.1 C6.1 C7.1 C8.1 C9.1 C10.1 C11.1 C12.1 C13.1 C14.1 C15.1 C16.1 C18.1 C19.1 C21.2 C22.1 C23.1 C24.1 C25.1 C26.2 C61.1 C62.1 D4.A E-STOP.2 ESP_PROG.2 EXP1.9 EXP2.9 EXP3.1 EXP3.19 I2C.2 J6.GND L1.2 LD1.2(K) LD2.2(K) LD3.2(K) LD4.2(K) LD5.2(K) LD6.2(K) LD7.2(K) LD8.2(K) LD9.2(K) LD10.2(K) MAIN-PWR1.1 PROBE.2 PS_ON.2 PWR_AUX.2 PWR_AUX.4 PWR_AUX.6 Q1.2(S) Q2.2(S) Q3.2(S) Q4.2(S) Q6.2(S) R22.1 R23.1 R25.2 R29.2 R30.1 R33.2 R37.2 R45.2 R46.2 R52.1 R64.1 R65.1 S1.2 SD_BREAKOUT.2 SWD.5 THERM_HEADER.2 THERM_HEADER.4 THERM_HEADER.6 THERM_HEADER.8 U1.6(VSS) U1.CD2 U1.MT1 U1.MT2 U2.10(VSS) U2.20(VSSA) U2.27(VSS) U2.49(VSS) U2.74(VSS) U2.99(VSS) U3.2(GND) U4.2(GND) U5.GND U11.2(GND) U11.5(WP) X-STOP.2 XT1.2(GND) Y-STOP.2 Z-STOP.2
HB_GND: C17.1 HB-PWR1.1 Q5.3(S) R52.2
VBUS: C6.2 D1.1(A) J6.VBUS U3.5(VBUS)
VIN: C21.1 C22.2 D2.K R62.1 U4.5(Vin)
VIN1: D2.A D3.K EXP3.20 FAN_VDD_SEL1.3 HE0.1 HE1.1 J2.3 PWR_AUX.1 Q7.4(S) R58.2
VIN2: C17.2 HB-OUT1.2 HB-PWR1.2
BEEPER: EXP1.1 U2.66(PC9) ; port BEEPER
BOOT0: BOOT1.2 R30.2 SWD.6 U2.94(BOOT0) ; port BOOT0
BTN_EN1: EXP2.5 U2.87(PD6) ; port BTN_EN1
BTN_EN2: EXP2.3 U2.81(PD0) ; port BTN_EN2
BTN_ENC: EXP1.2 U2.79(PC11) ; port BTN_ENC
E0_CS: U2.42(PE11) ; port E0_CS
E0_DIR: U2.37(PB2-BOOT1(PB2)) ; port E0_DIR
E0_STEP: U2.36(PB1) ; port E0_STEP
E1_CS: U2.35(PB0) ; port E1_CS
E1_DIR: U2.34(PC5) ; port E1_DIR
E1_STEP: U2.33(PC4) ; port E1_STEP
E2_CS: EXP3.10 U2.9(PC15-OSC32_OUT(PC15)) ; port E2_CS
E2_DIR: EXP3.9 U2.8(PC14-OSC32_IN(PC14)) ; port E2_DIR
E2_STEP: EXP3.8 U2.7(PC13) ; port E2_STEP
E3_CS: EXP3.13 U2.5(PE6) ; port E3_CS
E3_DIR: EXP3.12 U2.3(PE4) ; port E3_DIR
E3_STEP: EXP3.11 U2.4(PE5) ; port E3_STEP
E4_CS: EXP3.16 U2.2(PE3) ; port E4_CS
E4_DIR: EXP3.15 U2.1(PE2) ; port E4_DIR
E4_STEP: EXP3.14 U2.98(PE1) ; port E4_STEP
E_STOP: EXP3.7 R57.1 U2.38(PE7) ; port E_STOP
ESP_ADC: A1.2(ADC/TOUT) ; port ESP_ADC
ESP_DATA_RDY: A1.18(GPIO0/SPICS2) J4.2 R23.2 ; port ESP_DATA_RDY
ESP_EN: A1.3(EN) R13.1 U2.77(PA15(JTDI)) ; port ESP_EN
ESP_GPIO5: A1.20(GPIO5) ESP_PROG.6 ; port ESP_GPIO5
ESP_GPIO16: A1.4(GPIO16/~{WAKE}) ; port ESP_GPIO16
ESP_RST: A1.1(~{RST}) ESP_PROG.3 R14.1 U2.78(PC10) ; port ESP_RST
ESP_RX: R16.2 U2.69(PA10) ; port ESP_RX
ESP_RXD0: A1.21(GPIO3/RXD0) ESP_PROG.4 R17.1 ; port ESP_RXD0
ESP_SPI_CS: A1.16(GPIO15/HSPICS/RTS0/TXD2) R22.2 U2.51(PB12) ; port ESP_SPI_CS
ESP_TX: R17.2 U2.68(PA9) ; port ESP_TX
ESP_TXD0: A1.22(GPIO1/SPICS1/TXD0) ESP_PROG.5 R16.1 ; port ESP_TXD0
F0_PWM: R26.1 R28.2 R29.1 U2.60(PD13) ; port F0_PWM
F1_PWM: R34.1 R36.2 R37.1 U2.23(PA0-WKUP(PA0)) ; port F1_PWM
F2_PWM: R42.1 R44.2 R45.1 U2.24(PA1) ; port F2_PWM
H0_PWM: R21.1 R24.2 R25.1 U2.62(PD15) ; port H0_PWM
H1_PWM: R31.1 R32.2 R33.1 U2.61(PD14) ; port H1_PWM
HB_PWM: R41.1 R43.2 R46.1 U2.59(PD12) ; port HB_PWM
KILL: EXP2.10 U2.86(PD5) ; port KILL
LCD_D4: EXP1.5 U2.82(PD1) ; port LCD_D4
LCD_D5: EXP1.6 U2.83(PD2) ; port LCD_D5
LCD_D6: EXP1.7 U2.84(PD3) ; port LCD_D6
LCD_D7: EXP1.8 U2.85(PD4) ; port LCD_D7
LCD_EN: EXP1.3 U2.88(PD7) ; port LCD_EN
LCD_RS: EXP1.4 U2.80(PC12) ; port LCD_RS
MPU_TFR_RDY: A1.19(GPIO4) J3.2 ; port MPU_TFR_RDY
NRST: C5.2 EXP2.8 R27.1 S1.1 SWD.4 U2.14(NRST) ; port NRST
PS_ON: PS_ON.1 U2.26(PA3) ; port PS_ON
SCL_1: EXP3.18 I2C.4 R5.1 R10.2 U11.1(SCL) ; port SCL_1
SD_CSEL: EXP2.4 U2.92(PB6) ; port SD_CSEL
SD_DET: EXP2.7 U2.93(PB7) ; port SD_DET
SDA_1: EXP3.17 I2C.3 R6.1 R11.2 U11.3(SDA) ; port SDA_1
SPI1_MISO: R2.1 SD_BREAKOUT.4 U1.7(DATA_OUT) U2.31(PA6) ; port SPI1_MISO
SPI1_MOSI: R1.1 SD_BREAKOUT.5 U1.3(DATA_IN) U2.32(PA7) ; port SPI1_MOSI
SPI1_SCK: SD_BREAKOUT.3 U1.5(SCLK) U2.30(PA5) ; port SPI1_SCK
SPI2_MISO: A1.6(GPIO12/HSPIQ) U2.53(PB14) ; port SPI2_MISO
SPI2_MOSI: A1.7(GPIO13/HSPID/CTS0/RXD2) U2.54(PB15) ; port SPI2_MOSI
SPI2_SCK: A1.5(GPIO14/HSPICLK) U2.52(PB13) ; port SPI2_SCK
SPI3_MISO: EXP2.1 U2.90(PB4(NJTRST)) ; port SPI3_MISO
SPI3_MOSI: EXP2.6 U2.91(PB5) ; port SPI3_MOSI
SPI3_SCK: EXP2.2 U2.89(PB3(JTDO/TRACESWO)) ; port SPI3_SCK
SPI4_MISO: EXP3.4 U2.44(PE13) ; port SPI4_MISO
SPI4_MOSI: EXP3.5 U2.45(PE14) ; port SPI4_MOSI
SPI4_SCK: EXP3.3 U2.43(PE12) ; port SPI4_SCK
STAT_LED: R61.2 U2.25(PA2) ; port STAT_LED
STEP_EN: EXP3.6 R12.1 U2.97(PE0) ; port STEP_EN
SWCLK: J4.1 SWD.3 U2.76(PA14(JTCK-SWCLK)) ; port SWCLK
SWDIO: J3.1 SWD.2 U2.72(PA13(JTMS-SWDIO)) ; port SWDIO
THERM0: C15.2 R49.1 THERM_HEADER.1 U2.18(PC3) ; port THERM0
THERM1: C16.2 R50.1 THERM_HEADER.3 U2.17(PC2) ; port THERM1
THERM2: C18.2 R55.1 THERM_HEADER.5 U2.16(PC1) ; port THERM2
THERM3: C19.2 R56.1 THERM_HEADER.7 U2.15(PC0) ; port THERM3
USB_D_N: R35.2 U2.70(PA11) ; port USB_DM
USB_D_P: R38.2 U2.71(PA12) ; port USB_DP
USB_N: J6.D- U3.1(IN_1)
USB_P: J6.D+ U3.3(IN_2)
USD_CD: R4.1 SD_BREAKOUT.6 U2.67(PA8) ; port USD_CD
X_CS: U2.65(PC8) ; port X_CS
X_DIR: U2.64(PC7) ; port X_DIR
X_STEP: U2.63(PC6) ; port X_STEP
X_STOP: R51.1 U2.41(PE10) ; port X_STOP
Y_CS: U2.58(PD11) ; port Y_CS
Y_DIR: U2.57(PD10) ; port Y_DIR
Y_STEP: U2.56(PD9) ; port Y_STEP
Y_STOP: R53.1 U2.40(PE9) ; port Y_STOP
Z_CS: U2.55(PD8) ; port Z_CS
Z_DIR: U2.47(PB10) ; port Z_DIR
Z_PROBE: PROBE.3 U2.29(PA4) ; port Z_PROBE
Z_PROBEA: PROBE.4 ; port Z_PROBEA
Z_STEP: U2.46(PE15) ; port Z_STEP
Z_STOP: R54.1 U2.39(PE8) ; port Z_STOP
NetA1_17: A1.17(GPIO2/TXD1) R15.1
NetC2_2: C2.2 U2.73(VCAP_2)
NetC3_2: C3.2 U2.48(VCAP_1)
NetC20_1: C20.1 D4.K L2.1 U4.6(SW)
NetC20_2: C20.2 U4.1(BST)
NetD1_3: D1.3(K) F2.2
NetD3_A: D3.A Q7.3(G) R64.2
NetE-STOP_1: E-STOP.1 R57.2
NetF1_1: F1.1 J9.2
NetFANS_2: FANS.2 Q2.3(D)
NetFANS_4: FANS.4 Q4.3(D)
NetFANS_6: FANS.6 Q6.3(D)
NetHB-OUT1_1: HB-OUT1.1 Q5.2(D)
NetHE0_2: HE0.2 Q1.3(D)
NetHE1_2: HE1.2 Q3.3(D)
NetI2C_1: I2C.1 J1.2
NetJ6_SHIELD: J6.SHIELD(SH) L1.1
NetLD1_1: LD1.1(A) R24.1
NetLD2_1: LD2.1(A) R28.1
NetLD3_1: LD3.1(A) R32.1
NetLD4_1: LD4.1(A) R36.1
NetLD5_1: LD5.1(A) R43.1
NetLD6_1: LD6.1(A) R44.1
NetLD7_1: LD7.1(A) R58.1
NetLD8_1: LD8.1(A) R59.1
NetLD9_1: LD9.1(A) R60.1
NetLD10_1: LD10.1(A) R61.1
NetMAIN-PWR1_2: MAIN-PWR1.2 Q7.1(D)
NetQ1_1: Q1.1(G) R21.2
NetQ2_1: Q2.1(G) R26.2
NetQ3_1: Q3.1(G) R31.2
NetQ4_1: Q4.1(G) R34.2
NetQ5_1: Q5.1(G) R41.2
NetQ6_1: Q6.1(G) R42.2
NetR3_1: R3.1 R4.2 U1.CD1
NetR10_1: R10.1 U2.95(PB8)
NetR11_1: R11.1 U2.96(PB9)
NetR35_1: R35.1 U3.6(OUT_1)
NetR38_1: R38.1 U3.4(OUT_2)
NetR51_2: R51.2 X-STOP.1
NetR53_2: R53.2 Y-STOP.1
NetR54_2: R54.2 Z-STOP.1
NetR62_2: R62.2 U4.4(~{SHDN})
NetR63_1: R63.1 R65.2 U4.3(FB)
NetU2_12: U2.12(PH0-OSC_IN(PH0)) XT1.3(OUT)
NetU2_13: U2.13(PH1-OSC_OUT(PH1)) XT1.1(IN)

Not connected (* = marked no-connect by the designer): A1 9(SPI_MOSI/SD_CMD)* 10(SPI_MISO/SD_D0)* 11(GPIO9/SD_D2)* 12(GPIO10/SPI_CS/SD_D3)* 13(SPI_INT/SD_D1)* 14(SPI_CLK/SD_CLK)*; MH1 M3(0); MH2 M3(0); MH3 M3(0); MH4 M3(0); U1 1(DAT2)* 2(CS)* 8(DAT1)*

### Layout directives
differential pair: USB_D_N, USB_D_P, USB_N, USB_P

### Notes on the sheet
- EXP1 and EXP2 suit displays / control panels
- -buttons on interrupts
- -buzzer on timer's PWM output (TIM8 CH4)
- -dedicated SPI for SD access
- (near R4) 1-bit SDIO interface to SD
- -can be reconfigured for UART5 if needed
- EXP3 can be used for an expansion board
- HB F2 via TIM3 PWM
- -pins for three stepper drivers + SPI bus
- -I2C for expanding heaters / thermistors
- (near PS_ON) PS_ON needs to be 5V tolerant pin
- H0:1 F0:1 via TIM4 PWM
- (near PS_ON) (as most pins on the MCU are)
- Fan Voltage Select
- HE0 Output
- (near J2) Solder jumper to augment current-carrying
- (near J2) capacity of pin jumper if needed
- Update from UART0
- (near R23) Boot from Flash
- GPIO15
- ESP8266 Boot Modes
- 0
- GPIO2
- 1
- GPIO0
- FAN0 Output
- (near J3) Configuration Jumpers
- HE1 Output
- (near U3) USB ESD Protection
- FAN1 Output
- HB Output
- FAN2 Output
- Endstop Voltage Select
- (near PWR_AUX) Auxiliary Power
- (near F1) Endstop power is fused to
- (near F1) protect against wiring mistakes
- 5V 1.2A Buck Regulator
- Q7 provides reverse polarity protection
- 3.3V 1A LDO Regulator
- 4 x M3 mounting holes
- github.com/Aus3D/
- GPLv2
- Date:
- Revision:
- 0.1A
- 21/10/2016
- Vo = 0.8 * (1 + R1 / R2)
- < 10uF on 5V to comply
- with USB specification
- web url
- Drawn:
- Page:
- Chris Barr
- 1 of 2
- 54.9K & 10K =~ 5.2V
- Above 5V to increase LDO dropout margin
- (in symbol MICROSD) MICRO-SD

### Library data of the parts
BOOT1 PS_ON = Header 2: Header, 2-Pin; Note: Approved sub OK; LatestRevisionDate: 17-Jul-2002; LatestRevisionNote: Re-released for DXP Platform.; Publisher: Altium Limited; Supplier 1: Digi-Key; Supplier Part Number 1: 3M9447-ND
C1-C3 C7 C9 C15 C16 C18 C19 C25 = CapC-0402-4.7uF-10V: Capacitor (Semiconductor SIM Model); Voltage: 10V; Note: Approved sub OK; Published: 8-Jun-2000; Revision: July-2002: Re-released for DXP Platform.; Publisher: Altium Limited; Supplier 1: Digi-Key; Supplier Part Number 1: 1276-1482-1-ND
C4 C62 = CapC-0805-10uF 6.3V: Capacitor (Semiconductor SIM Model); Note: Approved sub OK; Published: 8-Jun-2000; Revision: July-2002: Re-released for DXP Platform.; Publisher: Altium Limited; Supplier 1: Digi-Key; Supplier Part Number 1: 1276-6457-1-ND
C5 C6 C8 C10-C14 C20 C61 = CapC-0402-100nF: as C27 on sheet stepperDrivers; Published: 8-Jun-2000; Revision: July-2002: Re-released for DXP Platform.; Publisher: Altium Limited; Supplier 1: Digi-Key; Supplier Part Number 1: 311-1336-1-ND
C17 = CapC-0603-1uF 50V: as C30 on sheet stepperDrivers; Published: 8-Jun-2000; Revision: July-2002: Re-released for DXP Platform.; Publisher: Altium Limited; Supplier 1: Digi-Key; Supplier Part Number 1: 1276-1860-1-ND
C21 = CapE-6.3-100uF-35V: as C31 on sheet stepperDrivers; Published: 8-Jun-2000; Revision: July-2002: Re-released for DXP Platform.; Publisher: Altium Limited; Supplier 1: Digi-Key; Supplier Part Number 1: PCE5016CT-ND
C22 = CapC-1210-4.7uF-50V: Capacitor (Semiconductor SIM Model); Note: Approved sub OK; Published: 8-Jun-2000; Revision: July-2002: Re-released for DXP Platform.; Publisher: Altium Limited; Supplier 1: Digi-Key; Supplier Part Number 1: 490-1864-1-ND
C23 C24 = CapC-0805-4.7uF 10V: Capacitor (Semiconductor SIM Model); Note: Approved sub OK; Published: 8-Jun-2000; Revision: July-2002: Re-released for DXP Platform.; Publisher: Altium Limited; Supplier 1: Digi-Key; Supplier Part Number 1: 1276-1244-1-ND
C26 = CapE-5.0-100uF-6.3V: Polarized Capacitor (Surface Mount); Note: Approved sub OK; Published: 8-Jun-2000; Revision: July-2002: Re-released for DXP Platform.; Publisher: Altium Limited; Supplier 1: Digi-Key; Supplier Part Number 1: 565-2057-1-ND
D1 = Diode Schottky 700mA 20V: Default Diode; Note: Approved sub OK; Revision: July-2002: Re-released for DXP Platform.; Supplier 1: Digi-Key; Supplier Part Number 1: DB3J208K0LCT-ND
D2 D4 = Diode Schottky 2A 40V: Default Diode; Code - JEDEC: DO-214-AB; Note: Approved sub OK; Published: 8-Jun-2000; Revision: July-2002: Re-released for DXP Platform.; Publisher: Altium Limited; Supplier 1: Digi-Key; Supplier Part Number 1: DB2W40200LCT-ND
D3 = Diode Zener 10V: Default Diode; Code - JEDEC: DO-214-AB; Note: Approved sub OK; Published: 8-Jun-2000; Revision: July-2002: Re-released for DXP Platform.; Publisher: Altium Limited; Supplier 1: Digi-Key; Supplier Part Number 1: DZ2S100M0LCT-ND
E-STOP FAN_VDD_SEL1 X-STOP Y-STOP Z-STOP = Header 3: Header, 3-Pin; Note: Approved sub OK; LatestRevisionDate: 17-Jul-2002; LatestRevisionNote: Re-released for DXP Platform.; Publisher: Altium Limited; Supplier 1: Digi-Key; Supplier Part Number 1: 3M9448-ND
ESP_PROG SD_BREAKOUT = Header 6x1: Header, 6-Pin; Note: Approved sub OK; LatestRevisionDate: 17-Jul-2002; LatestRevisionNote: Re-released for DXP Platform.; Publisher: Altium Limited; Supplier 1: Digi-Key; Supplier Part Number 1: 3M9449-ND
EXP1 EXP2 = Header 5X2: Header, 5-Pin, Dual row; Note: Approved sub OK; LatestRevisionDate: 17-Jul-2002; LatestRevisionNote: Re-released for DXP Platform.; Publisher: Altium Limited; Supplier 1: Digi-Key; Supplier Part Number 1: 3M9460-ND
EXP3 = Header 10X2: Header, 10-Pin, Dual row; Note: Approved sub OK; LatestRevisionDate: 17-Jul-2002; LatestRevisionNote: Re-released for DXP Platform.; Publisher: Altium Limited; Supplier 1: Digi-Key; Supplier Part Number 1: 3M155864-ND
F1 F2 = Fuse - 15V 200mA Trip PTC SMD 0603: Manufacturer 1: Holly Fuse; Manufacturer Part Number 1: 06T-0160L; Ratings: 160mA; 63VDC; slow-blow; SCDType: spec; Package / Case: 0603 (1608 metric); Supplier 1: Digi-Key; Supplier Part Number 1: 507-1821-1-ND
FANS = Header 3x2_MULTI: Header, 6-Pin; Note: Approved sub OK; LatestRevisionDate: 17-Jul-2002; LatestRevisionNote: Re-released for DXP Platform.; Publisher: Altium Limited; Supplier 1: Digi-Key; Supplier Part Number 1: 3M9459-ND
HB-OUT1 HB-PWR1 MAIN-PWR1 = ScrewTerminal-5mm-2Way: Note: Approved sub OK; Supplier 1: Digi-Key; Supplier Part Number 1: 277-6405-ND
HE0 HE1 = ScrewTerminal-3.5mm-2Way: Note: Approved sub OK; Supplier 1: Digi-Key; Supplier Part Number 1: 277-5719-ND
I2C PROBE = Header 4: Header, 4-Pin; Note: Approved sub OK; LatestRevisionDate: 17-Jul-2002; LatestRevisionNote: Re-released for DXP Platform.; Publisher: Altium Limited; Supplier 1: Digi-Key; Supplier Part Number 1: 3M9449-ND
J1 J2 J9 = JUMP3-NO: SMD jumper
J3 J4 = JUMP1-NO: SMD jumper
J6 = Micro-USB B Socket: Note: Approved sub OK; Supplier 1: Digi-Key; Supplier Part Number 1: WM1399CT-ND
L1 = Ferrite Bead SMD 0805: MagneticCore Inductor with Winding Polarity Marking; Value: WE-CBF_0805 (WE-CBF); Note: Approved sub OK; Published: 24-Mar-1999; Revision: July-2002: Re-released for DXP Platform.; Publisher: Altium Limited; Supplier 1: Digi-Key; Supplier Part Number 1: 490-1054-1-ND
L2 = Inductor SMD 33uH 2.5A: MagneticCore Inductor with Winding Polarity Marking; Published: 24-Mar-1999; Revision: July-2002: Re-released for DXP Platform.; Publisher: Altium Limited; Supplier 1: Digi-Key; Supplier Part Number 1: SRN6045TA-330MCT-ND
LD1-LD9 = LEDG  0603: Hyper-Bright LED; Note: Approved sub OK; Supplier 1: Digi-Key; Supplier Part Number 1: 160-1435-2-ND
LD10 = LEDY  0603: Hyper-Bright LED; Note: Approved sub OK; Supplier 1: Digi-Key; Supplier Part Number 1: 160-1437-1-ND
PWR_AUX SWD = Header 3X2: Header, 3-Pin, Dual row; Note: Approved sub OK; LatestRevisionDate: 17-Jul-2002; LatestRevisionNote: Re-released for DXP Platform.; Publisher: Altium Limited; Supplier 1: Digi-Key; Supplier Part Number 1: 3M9459-ND
Q1-Q4 Q6 = MOSFET - AO3400A: N-CH MOSFET 30V 5.7A SOT23; Supplier 1: Digi-Key; Supplier Part Number 1: 785-1000-1-ND
Q5 = MOSFET - PSMN1R8-40YLC: N-CH MOSFET 40V 100A LFPAK; Supplier 1: Digi-Key; Supplier Part Number 1: 568-10156-1-ND
Q7 = MOSFET - SIA453EDJ-T1-GE3: MOSFET SMD P-CH 30V 24A PowerPAK SC-70-6; Manufacturer 1: Fairchild Semiconductor; Manufacturer Part Number 1: BSS84; FET Type: MOSFET P-Channel, Metal Oxide; FET Feature: Logic Level Gate; Drain to Source Voltage (Vdss): 50V; Current - Continuous Drain (Id) @ 25° C: 130mA; Gate Charge (Qg) @ Vgs: 1.3nC @ 5V; Input Capacitance (Ciss) @ Vds: 73pF @ 25V; ComponentLink1URL: http://www.fairchildsemi.com/ds/BS/BSS84.pdf; ComponentLink1Description: http://www.fairchildsemi.com/ds/BS/BSS84.pdf; Supplier 1: Digi-Key; Supplier Part Number 1: SIA453EDJ-T1-GE3CT-ND
R1 R2 = Res-0402-47K: Resistor; Note: Approved sub OK; Published: 8-Jun-2000; Revision: July-2002: Re-released for DXP Platform.; Publisher: Altium Limited; Supplier 1: Digi-Key; Supplier Part Number 1: 311-47KJRCT-ND
R3 R12-R15 R22 R23 R27 R30 R65 = Res-0402-10K: Resistor; Note: Approved sub OK; Published: 8-Jun-2000; Revision: July-2002: Re-released for DXP Platform.; Publisher: Altium Limited; Supplier 1: Digi-Key; Supplier Part Number 1: 311-10KJRCT-ND
R4 R16 R17 R24 R28 R32 R36 R43 R44 R51 R53 R54 R57-R62 = Res-0402-1K: Resistor; Note: Approved sub OK; Published: 8-Jun-2000; Revision: July-2002: Re-released for DXP Platform.; Publisher: Altium Limited; Supplier 1: Digi-Key; Supplier Part Number 1: 311-1.0KJRCT-ND
R5 R6 = Res-0402-2K2: Resistor; Note: Approved sub OK; Published: 8-Jun-2000; Revision: July-2002: Re-released for DXP Platform.; Publisher: Altium Limited; Supplier 1: Digi-Key; Supplier Part Number 1: 311-2.2KJRCT-ND
R10 R11 = Res-0402-100R: Resistor; Note: Approved sub OK; Published: 8-Jun-2000; Revision: July-2002: Re-released for DXP Platform.; Publisher: Altium Limited; Supplier 1: Digi-Key; Supplier Part Number 1: 311-100JRCT-ND
R21 R26 R31 R34 R41 R42 = Res-0402-10R: Resistor; Note: Approved sub OK; Published: 8-Jun-2000; Revision: July-2002: Re-released for DXP Platform.; Publisher: Altium Limited; Supplier 1: Digi-Key; Supplier Part Number 1: 311-10JRCT-ND
R25 R29 R33 R37 R45 R46 R64 = Res-0402-100K: Resistor; Note: Approved sub OK; Published: 8-Jun-2000; Revision: July-2002: Re-released for DXP Platform.; Publisher: Altium Limited; Supplier 1: Digi-Key; Supplier Part Number 1: 311-100KJRCT-ND
R35 R38 = Res-0402-22R: Resistor; Note: Approved sub OK; Published: 8-Jun-2000; Revision: July-2002: Re-released for DXP Platform.; Publisher: Altium Limited; Supplier 1: Digi-Key; Supplier Part Number 1: 311-22JRCT-ND
R49 R50 R55 R56 = Res-0402-4K7: Resistor; Note: Approved sub OK; Published: 8-Jun-2000; Revision: July-2002: Re-released for DXP Platform.; Publisher: Altium Limited; Supplier 1: Digi-Key; Supplier Part Number 1: 311-4.7KJRCT-ND
R52 = Res-0402-EMPTY: Resistor; Note: Approved sub OK; Published: 8-Jun-2000; Revision: July-2002: Re-released for DXP Platform.; Publisher: Altium Limited
R63 = Res-0402-54.9K: Resistor; Note: Approved sub OK; Published: 8-Jun-2000; Revision: July-2002: Re-released for DXP Platform.; Publisher: Altium Limited; Supplier 1: Digi-Key; Supplier Part Number 1: YAG3185CT-ND
S1 = SW-PB: SMD Button; Note: Approved sub OK; Supplier 1: Digi-Key; Supplier Part Number 1: 679-2396-1-ND
THERM_HEADER = Header 8x1_MULTI: Header, 8-Pin; Note: Approved sub OK; LatestRevisionDate: 17-Jul-2002; LatestRevisionNote: Re-released for DXP Platform.; Publisher: Altium Limited; Supplier 1: Digi-Key; Supplier Part Number 1: 3M9449-ND
U1 = MICROSD: MicroSD Card Socket; Note: Approved sub OK; Supplier 1: Digi-Key; Supplier Part Number 1: 101-00660-68-6-1-ND
U2 = STM32F446VET6: ARM Cortex-M4 32-bit MCU+FPU, 210 DMIPS, 512 kB Flash, 128 kB Internal RAM, 81 I/Os, 100-pin LQFP, -40 to 105 degC, Tray; Manufacturer: STMicroelectronics; PartNumber: STM32F407VGT7; D/A Converter: 2x12-bit; FLASH Size (Prog) (kB): 1024; I/Os (High Current): 82; Internal RAM Size (kB): 192; Operating Frequency(F) (Processor speed) (MHz): 168; Supply Voltage(Vcc) max (V): 3.6; Supply Voltage(Vcc) min (V): 1.8; DatasheetVersion: Rev. 4; PackageVersion: Rev. 1, 06/2013; PackageReference: LQFP100; PackageDescription: 100-Pin Low Profile Quad Flat Package, 14 x 14 mm Body, 0.5 mm Pitch; Core: ARM Cortex-M4; Packing: Tray; Mounting Technology: Surface Mount; ComponentLink1Description: Manufacturer URL; ComponentLink1URL: http://www.st.com/web/en/home.html; ComponentLink2Description: Datasheet; ComponentLink2URL: http://www.st.com/st-web-ui/static/active/en/resource/technical/document/datasheet/DM00037051.pdf; ComponentLink3Description: Package Specification; ComponentLink3URL: http://www.st.com/st-web-ui/static/active/en/resource/technical/document/data_brief/DM00071938.pdf; Supplier 1: Digi-Key; Supplier Part Number 1: 497-15375-ND
U3 = USBLC6 USB ESD Protection: ESD Protection IC; Supplier 1: Digi-Key; Supplier Part Number 1: 497-5235-1-ND
U4 = Regulator - AOZ1282CI Buck Regulator: Buck Regulator; Supplier 1: Digi-Key; Supplier Part Number 1: 785-1613-1-ND
U5 = Regulator - AP2114 3.3V Linear Regulator: 3.3V LDO Regulator; Supplier 1: Digi-Key; Supplier Part Number 1: AP2114H-3.3TRG1DICT-ND
XT1 = Ceramic Resonator CSTCE12M0G55-R0: Ceramic Resonator; Supplier 1: Digi-Key; Supplier Part Number 1: 490-1197-1-ND
U11 = EEPROM - Serial I2C: Supplier 1: Digi-Key; Supplier Part Number 1: 24LC16BT-I/OTCT-ND

## Nets that join several sheets
+3V3: stepperDrivers (10 pins), R32-Micro (49 pins)
GND: stepperDrivers (64 pins), R32-Micro (96 pins)
VIN1: stepperDrivers (39 pins), R32-Micro (10 pins)
E0_CS: stepperDrivers (U9.18), R32-Micro (U2.42)
E0_DIR: stepperDrivers (E0_STEP.2 U9.41), R32-Micro (U2.37)
E0_STEP: stepperDrivers (E0_STEP.1 U9.42), R32-Micro (U2.36)
E1_CS: stepperDrivers (U10.18), R32-Micro (U2.35)
E1_DIR: stepperDrivers (E1_STEP.2 U10.41), R32-Micro (U2.34)
E1_STEP: stepperDrivers (E1_STEP.1 U10.42), R32-Micro (U2.33)
SPI4_MISO: stepperDrivers (5 pins), R32-Micro (EXP3.4 U2.44)
SPI4_MOSI: stepperDrivers (5 pins), R32-Micro (EXP3.5 U2.45)
SPI4_SCK: stepperDrivers (5 pins), R32-Micro (EXP3.3 U2.43)
STEP_EN: stepperDrivers (5 pins), R32-Micro (EXP3.6 R12.1 U2.97)
X_CS: stepperDrivers (U6.18), R32-Micro (U2.65)
X_DIR: stepperDrivers (U6.41 X_STEP.2), R32-Micro (U2.64)
X_STEP: stepperDrivers (U6.42 X_STEP.1), R32-Micro (U2.63)
Y_CS: stepperDrivers (U7.18), R32-Micro (U2.58)
Y_DIR: stepperDrivers (U7.41 Y_STEP.2), R32-Micro (U2.57)
Y_STEP: stepperDrivers (U7.42 Y_STEP.1), R32-Micro (U2.56)
Z_CS: stepperDrivers (U8.18), R32-Micro (U2.55)
Z_DIR: stepperDrivers (U8.41 Z_STEP.2), R32-Micro (U2.47)
Z_STEP: stepperDrivers (U8.42 Z_STEP.1), R32-Micro (U2.46)